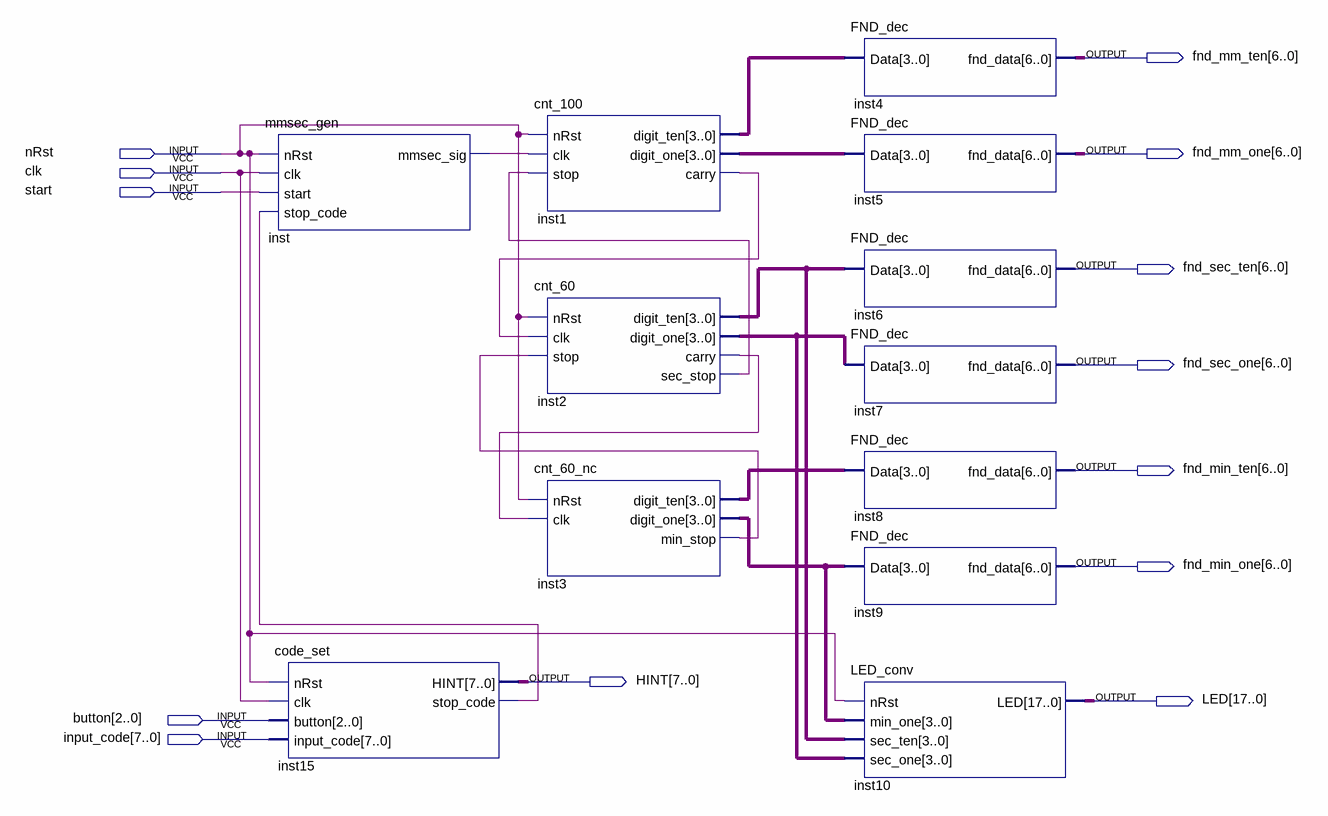
[diagram p0: schematic sheet]
// Quartus schematic BOOM.bdf as structural Verilog: 12 symbols, 13 pins
module BOOM (
  input  nRst,
  input  clk,
  input  start,
  input  [2:0] button,
  input  [7:0] input_code,
  output [6:0] fnd_mm_ten,
  output [6:0] fnd_mm_one,
  output [6:0] fnd_sec_ten,
  output [6:0] fnd_sec_one,
  output [6:0] fnd_min_ten,
  output [6:0] fnd_min_one,
  output [7:0] HINT,
  output [17:0] LED
);

  wire inst1_carry, inst2_carry, inst2_sec_stop, inst3_min_stop, inst15_stop_code, inst_mmsec_sig;
  wire [3:0] inst1_digit_one, inst1_digit_ten, inst2_digit_one, inst2_digit_ten, inst3_digit_one,
       inst3_digit_ten;

  mmsec_gen inst (.nRst(nRst), .clk(clk), .start(start), .stop_code(inst15_stop_code), .mmsec_sig(inst_mmsec_sig));
  code_set inst15 (
    .nRst(nRst), .clk(clk), .button(button), .input_code(input_code), .HINT(HINT),
    .stop_code(inst15_stop_code));
  cnt_100 inst1 (
    .nRst(nRst), .clk(inst_mmsec_sig), .stop(inst2_sec_stop), .digit_ten(inst1_digit_ten),
    .digit_one(inst1_digit_one), .carry(inst1_carry));
  cnt_60 inst2 (
    .nRst(nRst), .clk(inst1_carry), .stop(inst3_min_stop), .digit_ten(inst2_digit_ten),
    .digit_one(inst2_digit_one), .carry(inst2_carry), .sec_stop(inst2_sec_stop));
  cnt_60_nc inst3 (
    .nRst(nRst), .clk(inst2_carry), .digit_ten(inst3_digit_ten), .digit_one(inst3_digit_one),
    .min_stop(inst3_min_stop));
  FND_dec inst4 (.Data(inst1_digit_ten), .fnd_data(fnd_mm_ten));
  FND_dec inst5 (.Data(inst1_digit_one), .fnd_data(fnd_mm_one));
  FND_dec inst6 (.Data(inst2_digit_ten), .fnd_data(fnd_sec_ten));
  FND_dec inst7 (.Data(inst2_digit_one), .fnd_data(fnd_sec_one));
  FND_dec inst8 (.Data(inst3_digit_ten), .fnd_data(fnd_min_ten));
  FND_dec inst9 (.Data(inst3_digit_one), .fnd_data(fnd_min_one));
  LED_conv inst10 (
    .nRst(nRst), .min_one(inst3_digit_one), .sec_ten(inst2_digit_ten), .sec_one(inst2_digit_one), .LED(LED));
endmodule
